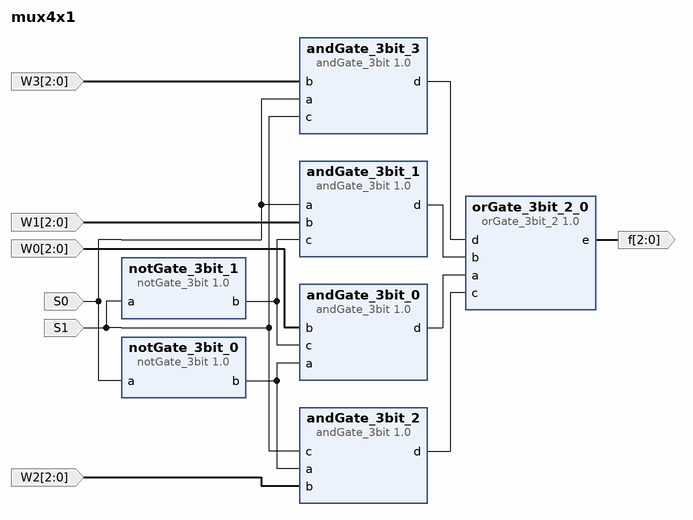
[diagram p0: block diagram of the top level]
# Vivado block design mux4x1, xc7a100tcsg324-1, Vivado 2018.3
create_bd_design mux4x1

create_bd_port -dir I -from 2 -to 0 W0
create_bd_port -dir I -from 2 -to 0 W1
create_bd_port -dir I -from 2 -to 0 W2
create_bd_port -dir I -from 2 -to 0 W3
create_bd_port -dir I S0
create_bd_port -dir I S1
create_bd_port -dir O -from 2 -to 0 f

create_bd_cell -type ip -vlnv xilinx.com:user:notGate_3bit:1.0 notGate_3bit_0
create_bd_cell -type ip -vlnv xilinx.com:user:notGate_3bit:1.0 notGate_3bit_1
create_bd_cell -type ip -vlnv xilinx.com:user:andGate_3bit:1.0 andGate_3bit_0
create_bd_cell -type ip -vlnv xilinx.com:user:andGate_3bit:1.0 andGate_3bit_1
create_bd_cell -type ip -vlnv xilinx.com:user:andGate_3bit:1.0 andGate_3bit_2
create_bd_cell -type ip -vlnv xilinx.com:user:andGate_3bit:1.0 andGate_3bit_3
create_bd_cell -type ip -vlnv xilinx.com:user:orGate_3bit_2:1.0 orGate_3bit_2_0

# ---- connections ----

connect_bd_net -net S0_1 [get_bd_ports S0] [get_bd_pins notGate_3bit_0/a] [get_bd_pins andGate_3bit_1/a] [get_bd_pins andGate_3bit_3/a]
connect_bd_net [get_bd_pins notGate_3bit_0/b] [get_bd_pins andGate_3bit_0/a] [get_bd_pins andGate_3bit_2/a]
connect_bd_net -net S1_1 [get_bd_ports S1] [get_bd_pins notGate_3bit_1/a] [get_bd_pins andGate_3bit_2/c] [get_bd_pins andGate_3bit_3/c]
connect_bd_net [get_bd_pins notGate_3bit_1/b] [get_bd_pins andGate_3bit_0/c] [get_bd_pins andGate_3bit_1/c]
connect_bd_net [get_bd_pins andGate_3bit_0/d] [get_bd_pins orGate_3bit_2_0/a]
connect_bd_net [get_bd_pins andGate_3bit_1/d] [get_bd_pins orGate_3bit_2_0/b]
connect_bd_net [get_bd_pins andGate_3bit_2/d] [get_bd_pins orGate_3bit_2_0/c]
connect_bd_net [get_bd_pins andGate_3bit_3/d] [get_bd_pins orGate_3bit_2_0/d]
connect_bd_net -net W0_1 [get_bd_ports W0] [get_bd_pins andGate_3bit_0/b]
connect_bd_net -net W1_1 [get_bd_ports W1] [get_bd_pins andGate_3bit_1/b]
connect_bd_net -net W2_1 [get_bd_ports W2] [get_bd_pins andGate_3bit_2/b]
connect_bd_net -net W3_1 [get_bd_ports W3] [get_bd_pins andGate_3bit_3/b]
connect_bd_net [get_bd_pins orGate_3bit_2_0/e] [get_bd_ports f]

validate_bd_design
save_bd_design
